# EAGLE schematic Arduino-M0-Pro-V4 (EAGLE 6.4)

## Sheet 1 of 3
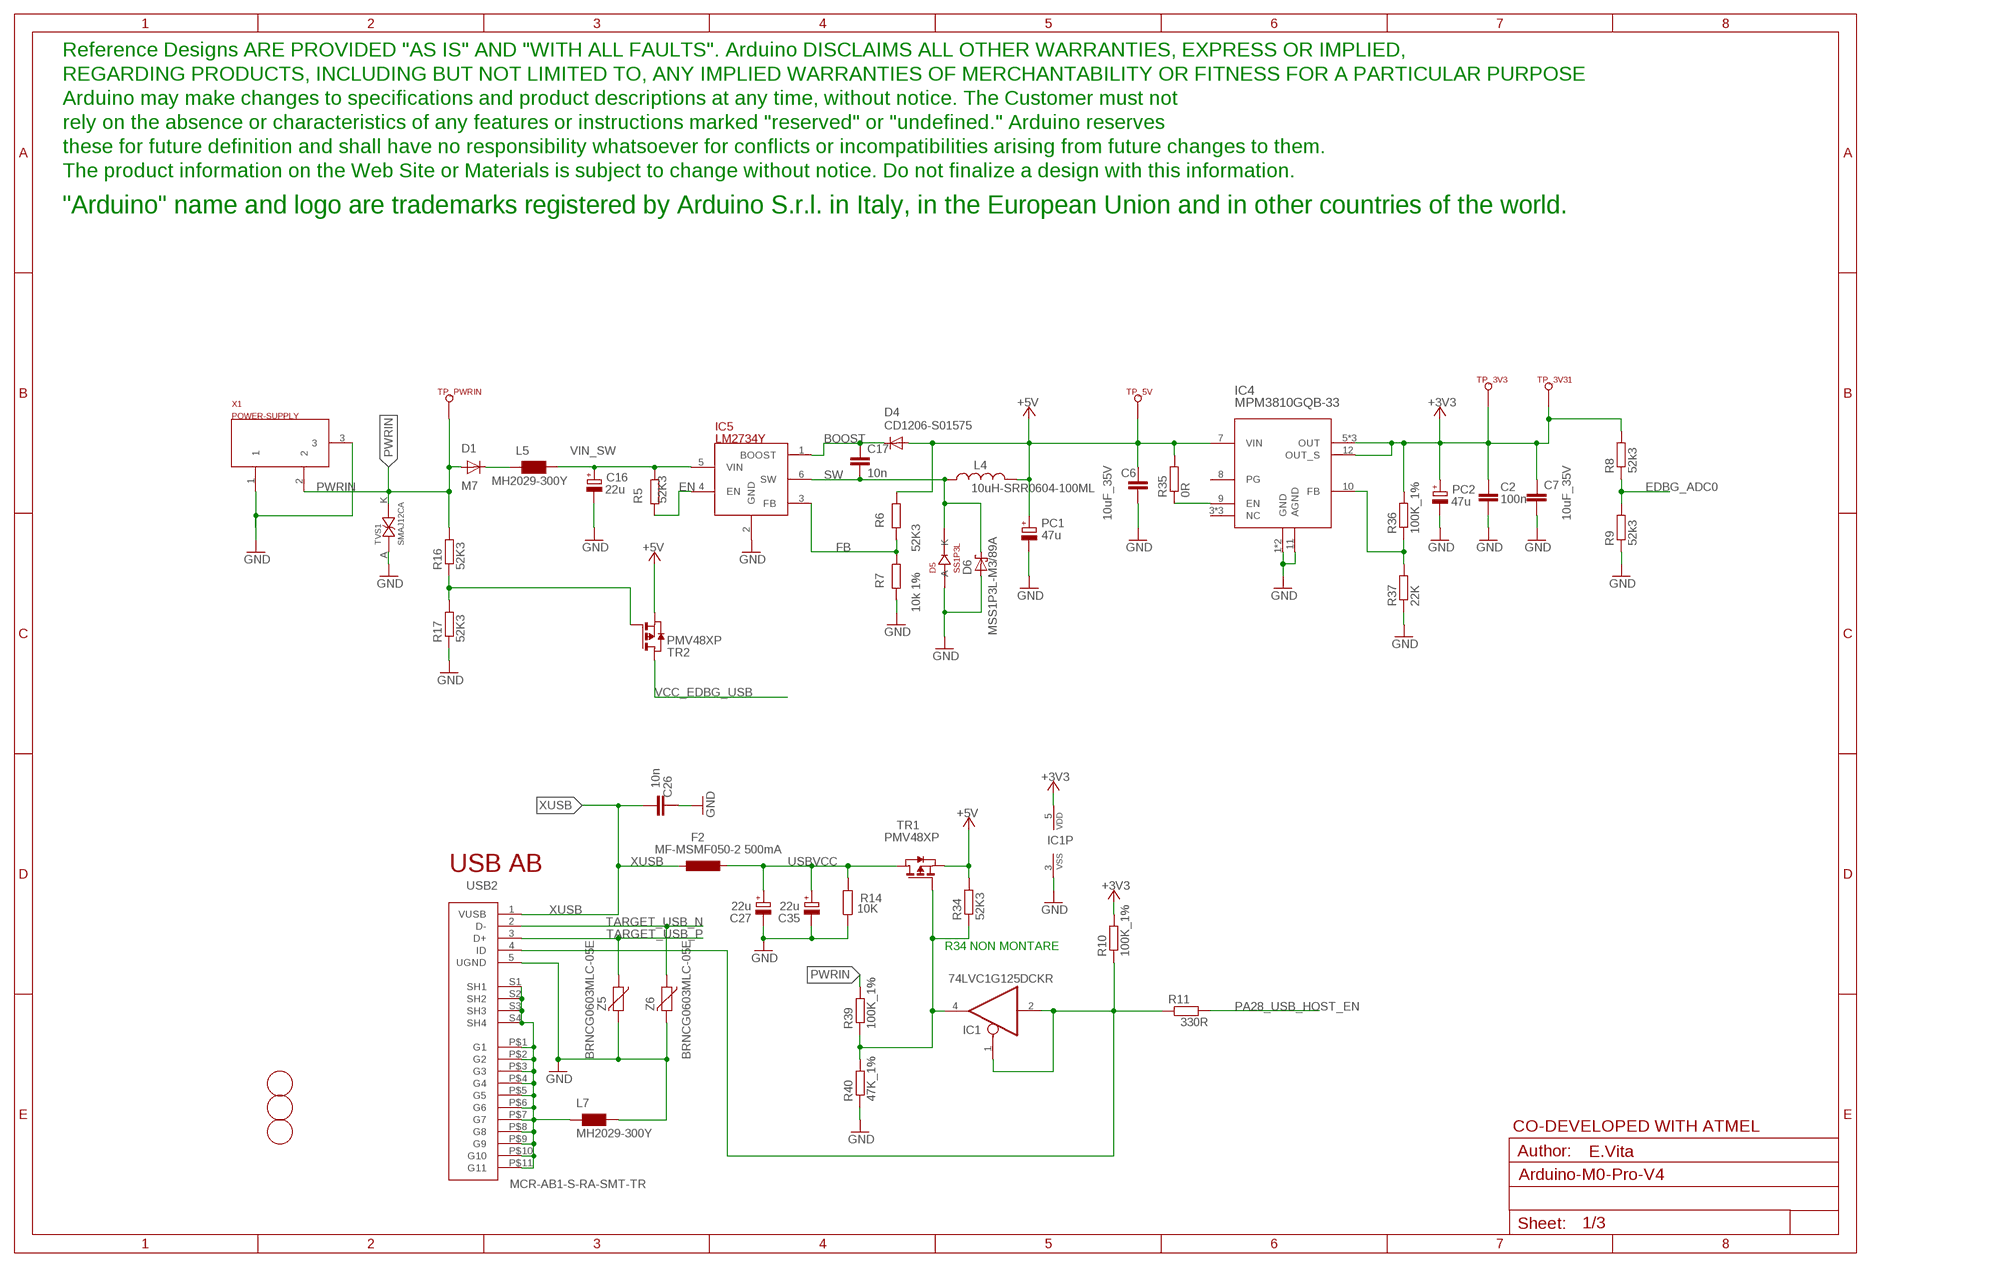
[diagram p0: schematic, sheet 1]

### Parts
C2  100n  0015_100NF_0603  [C0603-ROUND]
C6  10uF_35V  0674_GMK325BJ106KN-T  [C1210]
C7  10uF_35V  0674_GMK325BJ106KN-T  [C1210]
C16  22u  0167_  [SMC_B]
C17  10n  0142_10NF_0603  [C0603-ROUND]
C26  10n  0142_10NF_0603  [C0603-ROUND]
C27  22u  0167_  [SMC_B]
C35  22u  0167_  [SMC_B]
D1  M7  0020_M7  [SMB]
D4  CD1206-S01575  0012_CD1206-S01575  [MINIMELF]
D5  SS1P3L  0025_SS1P3L-M3/84A  [DO220AAL]
D6  MSS1P3L-M3/89A  1653_MSS1P3L-M3/89A  [MICROSMP]
F2  MF-MSMF050-2 500mA  0002_MF-MSMF050-2  [L1812]
FD1  FIDUCIALMOUNT  [FIDUCIA-MOUNT]
FD2  FIDUCIALMOUNT  [FIDUCIA-MOUNT]
FD3  FIDUCIALMOUNT  [FIDUCIA-MOUNT]
IC1  74LVC1G125DCKR  0040_SN74LVC1G125DCKR  [SC70-5]
IC4  MPM3810GQB-33  2068_MPM3810GQB-33  [QFN-12]
IC5  LM2734Y  0179_LM2734YMK  [SOT23-6]
L4  10uH-SRR0604-100ML  0031_SRR0604-100ML  [SRR0604]
L5  MH2029-300Y  0001_BLM21PG300SN1D_/_MH2029-300Y  [0805]
L7  MH2029-300Y  0001_BLM21PG300SN1D_/_MH2029-300Y  [0805]
PC1  47u  0113_47UF  [PANASONIC_D]
PC2  47u  0113_47UF  [PANASONIC_D]
R5  52K3  0180_52K3_0603  [R0603-ROUND]
R6  52K3  0180_52K3_0603  [R0603-ROUND]
R7  10k 1%  0899_CR0603FX1002ELF  [R0603-ROUND]
R8  52k3  0180_52K3_0603  [R0603-ROUND]
R9  52k3  0180_52K3_0603  [R0603-ROUND]
R10  100K_1%  2022_CR0603FW104L  [R0603-ROUND]
R11  330R  0049_330R_0603  [R0603-ROUND]
R14  10K  0028_CR0603JW103L  [R0603-ROUND]
R16  52K3  0180_52K3_0603  [R0603-ROUND]
R17  52K3  0180_52K3_0603  [R0603-ROUND]
R34  52K3  0180_52K3_0603  [R0603-ROUND]
R35  0R  0233_0R_0603  [R0603-ROUND]
R36  100K_1%  2022_CR0603FW104L  [R0603-ROUND]
R37  22K  0194_  [R0603-ROUND]
R39  100K_1%  2022_CR0603FW104L  [R0603-ROUND]
R40  47K_1%  0410_47K_0603_1%  [R0603-ROUND]
TP_3V3  TP_SP  [TP-SP]
TP_3V31  TP_SP  [TP-SP]
TP_5V  TP_SP  [TP-SP]
TP_PWRIN  TP_SP  [TP-SP]
TR1  PMV48XP  0297_PMV48XP  [SOT-23]
TR2  PMV48XP  0297_PMV48XP  [SOT-23]
TVS1  SMAJ12CA  XXXX_SMAJ12CA  [SMA-TVS]
U$1  DISCLAIMER  [DISCLAIMER]
USB2  MCR-AB1-S-RA-SMT-TR  0631_MCR-AB1-S-RA-SMT-TR  [MCR-AB1-S-RA-SMT]
X1  POWER-SUPPLY  0018_19746-POWER-SUPPLY  [POWERSUPPLY_DC-21MM]
Z5  BRNCG0603MLC-05E  0010_BRNCG0603MLC-05E  [CT/CN0603]
Z6  BRNCG0603MLC-05E  0010_BRNCG0603MLC-05E  [CT/CN0603]

### Nets
+3V3: C2.2 C7.1 IC1.5(VDD) IC4.5(OUT) IC4.6(OUT) IC4.12(OUT_S) IC4.14(OUT) PC2.+ R8.2 R10.2 R36.2 TP_3V3.X(TESTP) TP_3V31.X(TESTP) ; also sheet 2,3
+5V [usbvcc]: C6.1 D4.A IC4.7(VIN) L4.P$2 PC1.+ R6.1 R34.2 R35.2 TP_5V.X(TESTP) TR1.2(S) TR2.2(S) ; also sheet 2
BOOST: C17.1 D4.C IC5.1(BOOST)
EDBG_ADC0: R8.1 R9.2 ; also sheet 3
EN: IC5.4(EN) R5.2
FB: IC5.3(FB) R6.2 R7.1
GND [gnd]: C2.1 C6.2 C7.2 C16.- C26.2 C27.- C35.- D5.P$2(A) D6.A IC1.3(VSS) IC4.1(GND) IC4.2(GND) IC4.11(AGND) IC5.2(GND) L7.2 PC1.- PC2.- R7.2 R9.1 R14.1 R17.1 R37.1 R40.1 TVS1.A(AK) USB2.5(UGND) X1.1 X1.3 Z5.2 Z6.2 ; also sheet 2,3
N$4: IC1.4(O) R34.1 R39.1 R40.2 TR1.3(G)
N$7: IC1.1(OE) IC1.2(I) R10.1 R11.1 USB2.4(ID)
N$8: D1.C L5.1
N$9: IC4.9(EN) R35.1
N$11: IC4.10(FB) R36.1 R37.2
N$15 [gnd]: L7.1 USB2.P$1(G1) USB2.P$2(G2) USB2.P$3(G3) USB2.P$4(G4) USB2.P$5(G5) USB2.P$6(G6) USB2.P$7(G7) USB2.P$8(G8) USB2.P$9(G9) USB2.P$10(G10) USB2.P$11(G11) USB2.S1(SH1) USB2.S2(SH2) USB2.S3(SH3) USB2.S4(SH4)
N$16: R16.1 R17.2 TR2.3(G)
PA28_USB_HOST_EN: R11.2 ; also sheet 2
PWRIN [USB]: D1.A R16.2 R39.2 TP_PWRIN.X(TESTP) TVS1.K(KA) X1.2 ; also sheet 2
SW [USB]: C17.2 D5.P$1(K) D6.K(C) IC5.6(SW) L4.P$1
TARGET_USB_N [USBpair]: USB2.2(D-) Z6.1 ; also sheet 2
TARGET_USB_P [USBpair]: USB2.3(D+) Z5.1 ; also sheet 2
USBVCC [usbvcc]: C27.+ C35.+ F2.1 R14.2 TR1.1(D)
VCC_EDBG_USB: TR2.1(D) ; also sheet 3
VIN_SW [USB]: C16.+ IC5.5(VIN) L5.2 R5.1
XUSB [usbvcc]: C26.1 F2.2 USB2.1(VUSB)
Unconnected: IC4.3(NC) IC4.4(NC) IC4.8(PG) IC4.13(NC)

### Notes on the sheet
- USB AB
- R34 NON MONTARE
- CO-DEVELOPED WITH ATMEL
- E.Vita

## Sheet 2 of 3
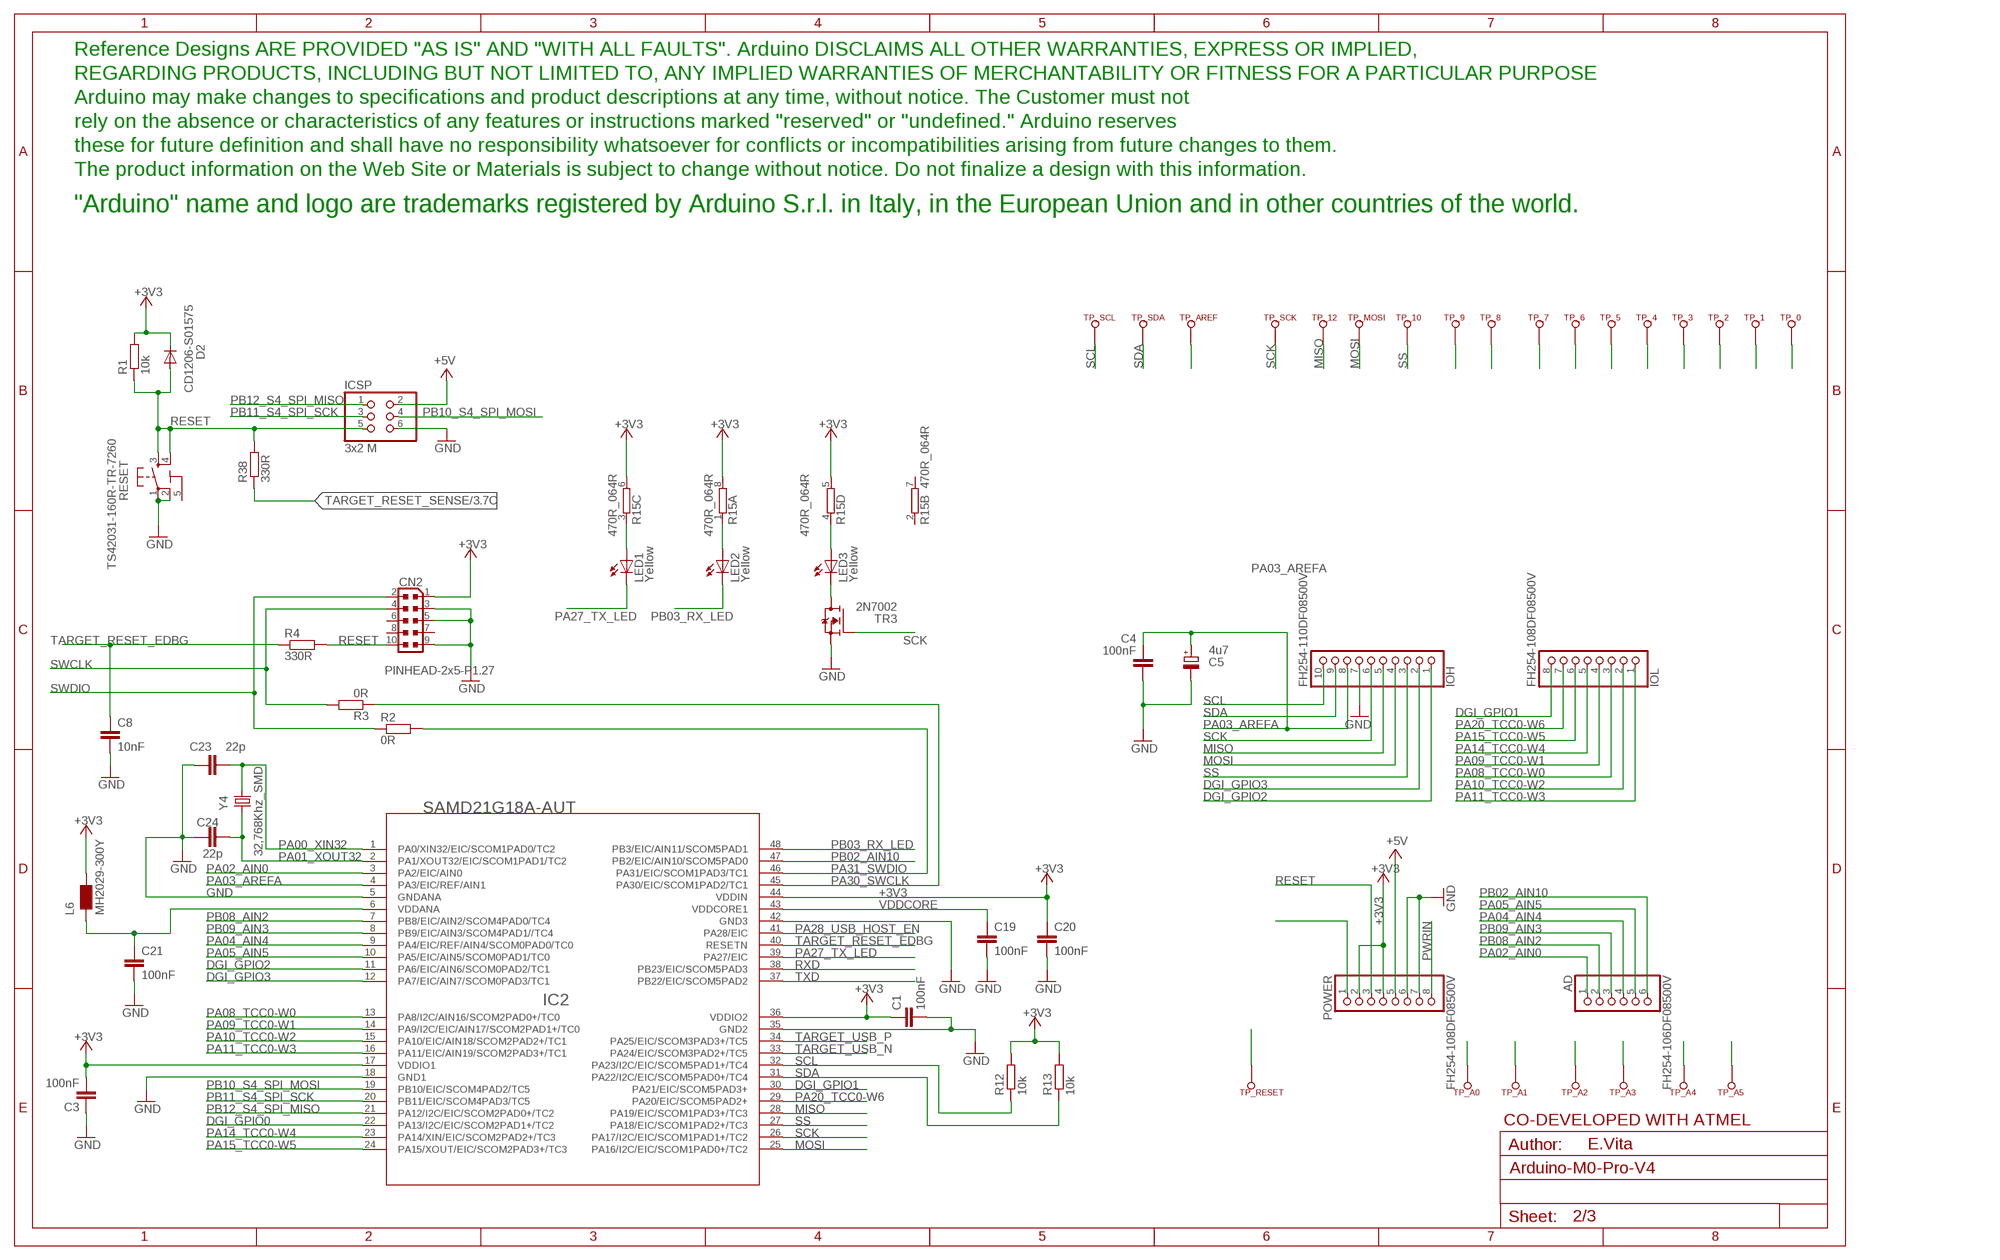
[diagram p1: schematic, sheet 2]

### Parts
AD  FH254-106DF08500V  1682_20TW-535_STD  [1X06]
C1  100nF  0015_100NF_0603  [C0603-ROUND]
C3  100nF  0015_100NF_0603  [C0603-ROUND]
C4  100nF  0015_100NF_0603  [C0603-ROUND]
C5  4u7  0474_TAJA475M016RNJ  [SMC_A]
C8  10nF  0142_10NF_0603  [C0603-ROUND]
C19  100nF  0015_100NF_0603  [C0603-ROUND]
C20  100nF  0015_100NF_0603  [C0603-ROUND]
C21  100nF  0015_100NF_0603  [C0603-ROUND]
C23  22p  0014_22PF_0603  [C0603-ROUND]
C24  22p  0014_22PF_0603  [C0603-ROUND]
CN2  PINHEAD-2x5-P1.27  0171_PH127-205DF055G00AROUND-PADS  [PINHEAD_2X05_127]
D2  CD1206-S01575  0012_CD1206-S01575  [MINIMELF]
IC2  SAMD21G18A-AUT  1792_SAMD21G18A-AUT  [TQFP48-7X7]
ICSP  3x2 M  0114_PH254-203DF118A00V  [2X03]
IOH  FH254-110DF08500V  1684_20TW-537  [1X10]
IOL  FH254-108DF08500V  1683_20TW-536  [1X08]
L6  MH2029-300Y  0001_BLM21PG300SN1D_/_MH2029-300Y  [0805]
LED1  Yellow  0044_KPT-2012YC  [CHIPLED_0805]
LED2  Yellow  0044_KPT-2012YC  [CHIPLED_0805]
LED3  Yellow  0044_KPT-2012YC  [CHIPLED_0805]
POWER  FH254-108DF08500V  1683_20TW-536  [1X08]
R1  10k  0028_CR0603JW103L  [R0603-ROUND]
R2  0R  0233_0R_0603  [R0603-ROUND]
R3  0R  0233_0R_0603  [R0603-ROUND]
R4  330R  0049_330R_0603  [R0603-ROUND]
R12  10k  0028_CR0603JW103L  [R0603-ROUND]
R13  10k  0028_CR0603JW103L  [R0603-ROUND]
R15  470R_064R  0540_CAY16-471J4LF  [CAY16]
R38  330R  0049_330R_0603  [R0603-ROUND]
RESET  TS42031-160R-TR-7260  0946_TS42031-160W-TR-7260  [TS42]
TP_0  TP_SP  [TP-SP]
TP_1  TP_SP  [TP-SP]
TP_2  TP_SP  [TP-SP]
TP_3  TP_SP  [TP-SP]
TP_4  TP_SP  [TP-SP]
TP_5  TP_SP  [TP-SP]
TP_6  TP_SP  [TP-SP]
TP_7  TP_SP  [TP-SP]
TP_8  TP_SP  [TP-SP]
TP_9  TP_SP  [TP-SP]
TP_10  TP_SP  [TP-SP]
TP_12  TP_SP  [TP-SP]
TP_A0  TP_SP  [TP-SP]
TP_A1  TP_SP  [TP-SP]
TP_A2  TP_SP  [TP-SP]
TP_A3  TP_SP  [TP-SP]
TP_A4  TP_SP  [TP-SP]
TP_A5  TP_SP  [TP-SP]
TP_AREF  TP_SP  [TP-SP]
TP_MOSI  TP_SP  [TP-SP]
TP_RESET  TP_SP  [TP-SP]
TP_SCK  TP_SP  [TP-SP]
TP_SCL  TP_SP  [TP-SP]
TP_SDA  TP_SP  [TP-SP]
TR3  2N7002  1612_2N7002LT1G  [SOT-23]
U$2  DISCLAIMER  [DISCLAIMER]
Y4  32,768Khz_SMD  0213_ABS07-32.768KHZ-T  [RESONATOR_EPSON_FC_145]

### Nets
+3V3: C1.1 C3.2 C20.1 CN2.1 D2.C IC2.17(VDDIO1) IC2.36(VDDIO2) IC2.44(VDDIN) L6.2 POWER.2 POWER.4 R1.2 R12.2 R13.2 R15.5 R15.6 R15.8 ; also sheet 1,3
+5V [usbvcc]: ICSP.2 POWER.5 ; also sheet 1
DGI_GPIO0: IC2.22(PA13/I2C/EIC/SCOM2PAD1+/TC2) ; also sheet 3
DGI_GPIO1: IC2.30(PA21/EIC/SCOM5PAD3+) IOL.8 TP_7.X(TESTP) ; also sheet 3
DGI_GPIO2: IC2.11(PA6/EIC/AIN6/SCOM0PAD2/TC1) IOH.1 TP_8.X(TESTP) ; also sheet 3
DGI_GPIO3: IC2.12(PA7/EIC/AIN7/SCOM0PAD3/TC1) IOH.2 TP_9.X(TESTP) ; also sheet 3
GND [gnd]: C1.2 C3.1 C4.2 C5.- C8.2 C19.2 C20.2 C21.2 C23.1 C24.1 CN2.3 CN2.5 CN2.9 IC2.5(GNDANA) IC2.18(GND1) IC2.35(GND2) IC2.42(GND3) ICSP.6 IOH.7 POWER.6 POWER.7 RESET.1 RESET.2 TR3.2(S) ; also sheet 1,3
MISO: IC2.28(PA19/EIC/SCOM1PAD3+/TC3) IOH.5 TP_12.X(TESTP) ; also sheet 3
MOSI: IC2.25(PA16/I2C/EIC/SCOM1PAD0+/TC2) IOH.4 TP_MOSI.X(TESTP) ; also sheet 3
N$3: LED3.C TR3.1(D)
N$10: C21.1 IC2.6(VDDANA) L6.1
N$20: LED1.A R15.3
N$21: LED2.A R15.1
N$22: LED3.A R15.4
N$56: POWER.1
PA00_XIN32: C23.2 IC2.1(PA0/XIN32/EIC/SCOM1PAD0/TC2) Y4.P$2
PA01_XOUT32: C24.2 IC2.2(PA1/XOUT32/EIC/SCOM1PAD1/TC2) Y4.P$1
PA02_AIN0: AD.1 IC2.3(PA2/EIC/AIN0) TP_A0.X(TESTP)
PA03_AREFA: C4.1 C5.+ IC2.4(PA3/EIC/REF/AIN1) IOH.8 TP_AREF.X(TESTP)
PA04_AIN4: AD.4 IC2.9(PA4/EIC/REF/AIN4/SCOM0PAD0/TC0) TP_A3.X(TESTP)
PA05_AIN5: AD.5 IC2.10(PA5/EIC/AIN5/SCOM0PAD1/TC0) TP_A4.X(TESTP)
PA08_TCC0-W0: IC2.13(PA8/I2C/AIN16/SCOM2PAD0+/TC0) IOL.3 TP_2.X(TESTP)
PA09_TCC0-W1: IC2.14(PA9/I2C/EIC/AIN17/SCOM2PAD1+/TC0) IOL.4 TP_3.X(TESTP)
PA10_TCC0-W2: IC2.15(PA10/EIC/AIN18/SCOM2PAD2+/TC1) IOL.2 TP_1.X(TESTP)
PA11_TCC0-W3: IC2.16(PA11/EIC/AIN19/SCOM2PAD3+/TC1) IOL.1 TP_0.X(TESTP)
PA14_TCC0-W4: IC2.23(PA14/XIN/EIC/SCOM2PAD2+/TC3) IOL.5 TP_4.X(TESTP)
PA15_TCC0-W5: IC2.24(PA15/XOUT/EIC/SCOM2PAD3+/TC3) IOL.6 TP_5.X(TESTP)
PA20_TCC0-W6: IC2.29(PA20/EIC/SCOM5PAD2+) IOL.7 TP_6.X(TESTP)
PA27_TX_LED: IC2.39(PA27/EIC) LED1.C
PA28_USB_HOST_EN: IC2.41(PA28/EIC) ; also sheet 1
PA30_SWCLK: IC2.45(PA30/EIC/SCOM1PAD2/TC1) R3.1
PA31_SWDIO: IC2.46(PA31/EIC/SCOM1PAD3/TC1) R2.2
PB02_AIN10: AD.6 IC2.47(PB2/EIC/AIN10/SCOM5PAD0) TP_A5.X(TESTP)
PB03_RX_LED: IC2.48(PB3/EIC/AIN11/SCOM5PAD1) LED2.C
PB08_AIN2: AD.2 IC2.7(PB8/EIC/AIN2/SCOM4PAD0/TC4) TP_A1.X(TESTP)
PB09_AIN3: AD.3 IC2.8(PB9/EIC/AIN3/SCOM4PAD1//TC4) TP_A2.X(TESTP)
PB10_S4_SPI_MOSI: IC2.19(PB10/EIC/SCOM4PAD2/TC5) ICSP.4
PB11_S4_SPI_SCK: IC2.20(PB11/EIC/SCOM4PAD3/TC5) ICSP.3
PB12_S4_SPI_MISO: IC2.21(PA12/I2C/EIC/SCOM2PAD0+/TC2) ICSP.1
PWRIN [USB]: POWER.8 ; also sheet 1
RESET: CN2.10 D2.A ICSP.5 POWER.3 R1.1 R4.2 R38.2 RESET.3 RESET.4 TP_RESET.X(TESTP)
RXD: IC2.38(PB23/EIC/SCOM5PAD3) ; also sheet 3
SCK: IC2.26(PA17/I2C/EIC/SCOM1PAD1+/TC2) IOH.6 TP_SCK.X(TESTP) TR3.3(G) ; also sheet 3
SCL: IC2.32(PA23/I2C/EIC/SCOM5PAD1+/TC4) IOH.10 R12.1 TP_SCL.X(TESTP) ; also sheet 3
SDA: IC2.31(PA22/I2C/EIC/SCOM5PAD0+/TC4) IOH.9 R13.1 TP_SDA.X(TESTP) ; also sheet 3
SS: IC2.27(PA18/EIC/SCOM1PAD2+/TC3) IOH.3 TP_10.X(TESTP) ; also sheet 3
SWCLK: CN2.4 R3.2 ; also sheet 3
SWDIO: CN2.2 R2.1 ; also sheet 3
TARGET_RESET_EDBG: C8.1 IC2.40(RESETN) R4.1 ; also sheet 3
TARGET_RESET_SENSE: R38.1 ; also sheet 3
TARGET_USB_N [USBpair]: IC2.33(PA24/EIC/SCOM3PAD2+/TC5) ; also sheet 1
TARGET_USB_P [USBpair]: IC2.34(PA25/EIC/SCOM3PAD3+/TC5) ; also sheet 1
TXD: IC2.37(PB22/EIC/SCOM5PAD2) ; also sheet 3
VDDCORE: C19.1 IC2.43(VDDCORE1)
Unconnected: CN2.6 CN2.7 CN2.8 R15.2 R15.7

### Notes on the sheet
- CO-DEVELOPED WITH ATMEL
- E.Vita

## Sheet 3 of 3
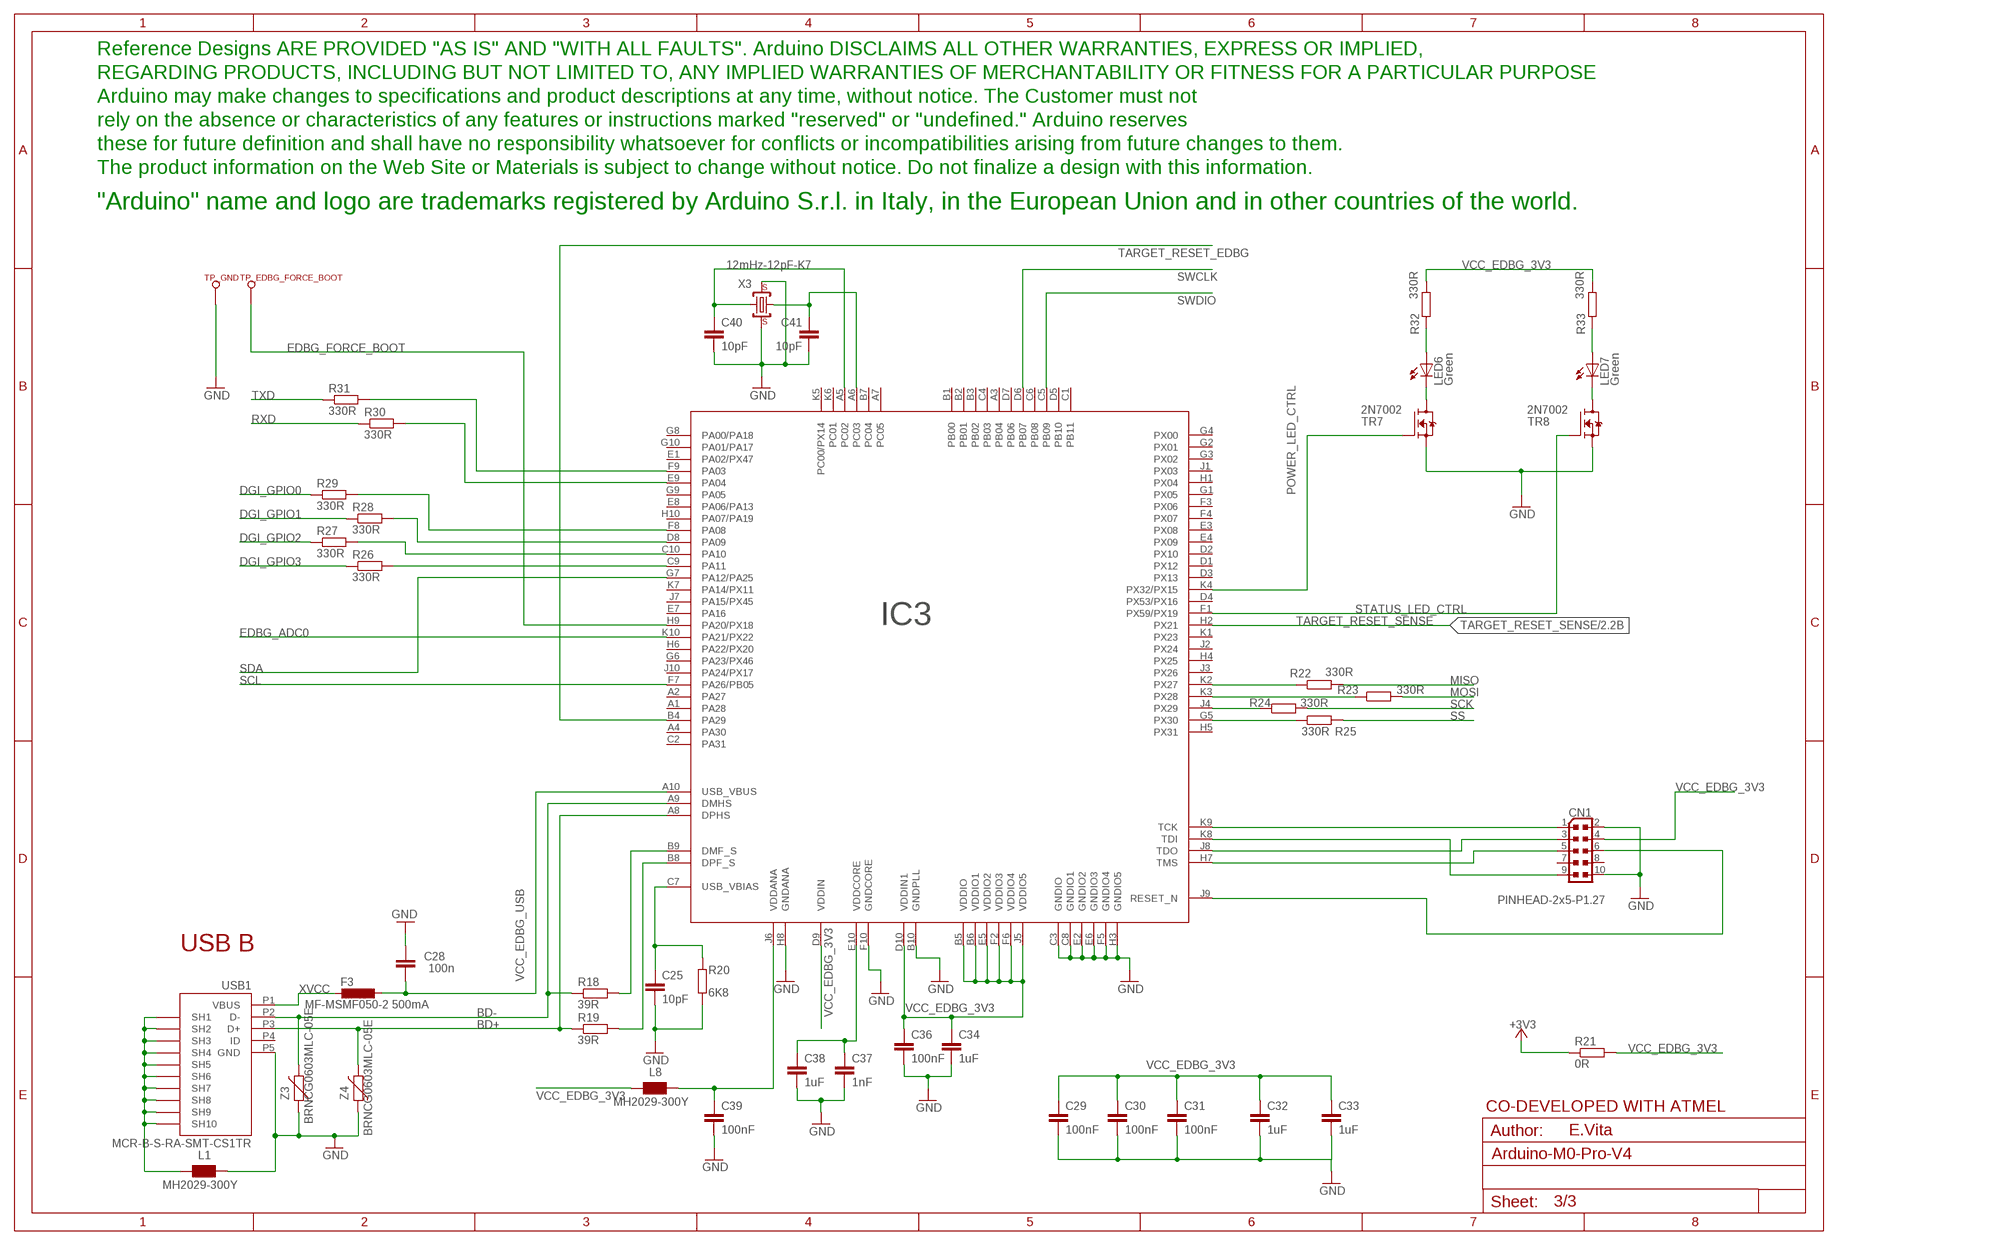
[diagram p2: schematic, sheet 3]

### Parts
C25  10pF  0245_0603C0G10PF50V  [C0603-ROUND]
C28  100n  0015_100NF_0603  [C0603-ROUND]
C29  100nF  0015_100NF_0603  [C0603-ROUND]
C30  100nF  0015_100NF_0603  [C0603-ROUND]
C31  100nF  0015_100NF_0603  [C0603-ROUND]
C32  1uF  0006_1UF_0603/GRM188R61E105KA12D  [C0603-ROUND]
C33  1uF  0006_1UF_0603/GRM188R61E105KA12D  [C0603-ROUND]
C34  1uF  0006_1UF_0603/GRM188R61E105KA12D  [C0603-ROUND]
C36  100nF  0015_100NF_0603  [C0603-ROUND]
C37  1nF  0408_1NF_0603  [C0603-ROUND]
C38  1uF  0006_1UF_0603/GRM188R61E105KA12D  [C0603-ROUND]
C39  100nF  0015_100NF_0603  [C0603-ROUND]
C40  10pF  0245_0603C0G10PF50V  [C0603-ROUND]
C41  10pF  0245_0603C0G10PF50V  [C0603-ROUND]
CN1  PINHEAD-2x5-P1.27  0171_PH127-205DF055G00AROUND-PADS  [PINHEAD_2X05_127]
F3  MF-MSMF050-2 500mA  0002_MF-MSMF050-2  [L1812]
IC3  1791_AT32UC3A4256HHB-C1UR  [VFBGA100]
L1  MH2029-300Y  0001_BLM21PG300SN1D_/_MH2029-300Y  [0805]
L8  MH2029-300Y  0001_BLM21PG300SN1D_/_MH2029-300Y  [0805]
LED6  Green  0043_KPT-2012SGC  [CHIPLED_0805]
LED7  Green  0043_KPT-2012SGC  [CHIPLED_0805]
R18  39R  0176_39_R_0603  [R0603-ROUND]
R19  39R  0176_39_R_0603  [R0603-ROUND]
R20  6K8  0164_6K8_0603  [R0603-ROUND]
R21  0R  0233_0R_0603  [R0603-ROUND]
R22  330R  0049_330R_0603  [R0603-ROUND]
R23  330R  0049_330R_0603  [R0603-ROUND]
R24  330R  0049_330R_0603  [R0603-ROUND]
R25  330R  0049_330R_0603  [R0603-ROUND]
R26  330R  0049_330R_0603  [R0603-ROUND]
R27  330R  0049_330R_0603  [R0603-ROUND]
R28  330R  0049_330R_0603  [R0603-ROUND]
R29  330R  0049_330R_0603  [R0603-ROUND]
R30  330R  0049_330R_0603  [R0603-ROUND]
R31  330R  0049_330R_0603  [R0603-ROUND]
R32  330R  0049_330R_0603  [R0603-ROUND]
R33  330R  0049_330R_0603  [R0603-ROUND]
TP_EDBG_FORCE_BOOT  TP_SP  [TP-SP]
TP_GND  TP_SP  [TP-SP]
TR7  2N7002  1612_2N7002LT1G  [SOT-23]
TR8  2N7002  1612_2N7002LT1G  [SOT-23]
U$3  DISCLAIMER  [DISCLAIMER]
USB1  MCR-B-S-RA-SMT-CS1TR  0158_MCR-B-S-RA-SMT-CS1TR  [CON2_USB_MICRO_B_AT]
X3  12mHz-12pF-K7  0396_12MHZ-12PF-K7  [CRYSTAL-3.2-2.5]
Z3  BRNCG0603MLC-05E  0010_BRNCG0603MLC-05E  [CT/CN0603]
Z4  BRNCG0603MLC-05E  0010_BRNCG0603MLC-05E  [CT/CN0603]

### Nets
+3V3: R21.1 ; also sheet 1,2
BD+ [USBpair]: IC3.A8(DPHS) R19.1 USB1.P3(D+) Z4.2
BD- [USBpair]: IC3.A9(DMHS) R18.1 USB1.P2(D-) Z3.2
DGI_GPIO0: R29.1 ; also sheet 2
DGI_GPIO1: R28.1 ; also sheet 2
DGI_GPIO2: R27.1 ; also sheet 2
DGI_GPIO3: R26.1 ; also sheet 2
EDBG_ADC0: IC3.K10(PA21/PX22) ; also sheet 1
EDBG_FORCE_BOOT: IC3.H9(PA20/PX18) TP_EDBG_FORCE_BOOT.X(TESTP)
GND [gnd]: C25.2 C28.2 C29.2 C30.2 C31.2 C32.2 C33.2 C34.2 C36.2 C37.2 C38.2 C39.2 C40.2 C41.2 CN1.2 CN1.10 IC3.B10(GNDPLL) IC3.C3(GNDIO) IC3.C8(GNDIO1) IC3.E2(GNDIO2) IC3.E6(GNDIO3) IC3.F5(GNDIO4) IC3.F10(GNDCORE) IC3.H3(GNDIO5) IC3.H8(GNDANA) L1.2 R20.1 TP_GND.X(TESTP) TR7.2(S) TR8.2(S) USB1.P5(GND) X3.2(GND) X3.4(GND) Z3.1 Z4.1 ; also sheet 1,2
MISO: R22.2 ; also sheet 2
MOSI: R23.2 ; also sheet 2
N$1: LED6.C TR7.1(D)
N$2: LED7.C TR8.1(D)
N$5 [gnd]: L1.1 USB1.P$1(SH7) USB1.P$2(SH8) USB1.P$3(SH9) USB1.P$4(SH10) USB1.P$5(SH7) USB1.P$6(SH8) USB1.P$7(SH9) USB1.P$8(SH10) USB1.S1(SH1) USB1.S2(SH2) USB1.S3(SH3) USB1.S4(SH4) USB1.S5(SH5) USB1.S6(SH6)
N$18: IC3.B9(DMF_S) R18.2
N$19: IC3.B8(DPF_S) R19.2
N$23: C25.1 IC3.C7(USB_VBIAS) R20.2
N$24: C41.1 IC3.A6(PC03) X3.1(C1)
N$25: C40.1 IC3.A5(PC02) X3.3(C2)
N$26: C37.1 C38.1 IC3.E10(VDDCORE)
N$27: C39.1 IC3.J6(VDDANA) L8.2
N$34: IC3.K2(PX27) R22.1
N$37: IC3.K3(PX28) R23.1
N$38: IC3.J4(PX29) R24.1
N$39: IC3.G5(PX30) R25.1
N$40: IC3.C9(PA11) R26.2
N$41: IC3.C10(PA10) R27.2
N$42: IC3.D8(PA09) R28.2
N$43: IC3.F8(PA08) R29.2
N$44: IC3.E9(PA04) R30.2
N$45: IC3.F9(PA03) R31.2
N$57: CN1.1 IC3.K9(TCK)
N$58: CN1.9 IC3.K8(TDI)
N$59: CN1.3 IC3.J8(TDO)
N$60: CN1.5 IC3.H7(TMS)
N$61: CN1.6 IC3.J9(RESET_N)
N$67: LED6.A R32.1
N$68: LED7.A R33.1
POWER_LED_CTRL: IC3.K4(PX32/PX15) TR7.3(G)
RXD: R30.1 ; also sheet 2
SCK: R24.2 ; also sheet 2
SCL: IC3.F7(PA26/PB05) ; also sheet 2
SDA: IC3.G7(PA12/PA25) ; also sheet 2
SS: R25.2 ; also sheet 2
STATUS_LED_CTRL: IC3.F1(PX59/PX19) TR8.3(G)
SWCLK: IC3.D6(PB07) ; also sheet 2
SWDIO: IC3.C5(PB09) ; also sheet 2
TARGET_RESET_EDBG: IC3.B4(PA29) ; also sheet 2
TARGET_RESET_SENSE: IC3.H2(PX21) ; also sheet 2
TXD: R31.1 ; also sheet 2
VCC_EDBG_3V3: C29.1 C30.1 C31.1 C32.1 C33.1 C34.1 C36.1 CN1.4 IC3.B5(VDDIO) IC3.B6(VDDIO1) IC3.D9(VDDIN) IC3.D10(VDDIN1) IC3.E5(VDDIO2) IC3.F2(VDDIO3) IC3.F6(VDDIO4) IC3.J5(VDDIO5) L8.1 R21.2 R32.2 R33.2
VCC_EDBG_USB: C28.1 F3.1 IC3.A10(USB_VBUS) ; also sheet 1
XVCC [usbvcc]: F3.2 USB1.P1(VBUS)
Unconnected: CN1.7 CN1.8 IC3.A1(PA28) IC3.A2(PA27) IC3.A3(PB04) IC3.A4(PA30) IC3.A7(PC05) IC3.B1(PB00) IC3.B2(PB01) IC3.B3(PB02) IC3.B7(PC04) IC3.C1(PB11) IC3.C2(PA31) IC3.C4(PB03) IC3.C6(PB08) IC3.D1(PX12) IC3.D2(PX10) IC3.D3(PX13) IC3.D4(PX53/PX16) IC3.D5(PB10) IC3.D7(PB06) IC3.E1(PA02/PX47) IC3.E3(PX08) IC3.E4(PX09) IC3.E7(PA16) IC3.E8(PA06/PA13) IC3.F3(PX06) IC3.F4(PX07) IC3.G1(PX05) IC3.G2(PX01) IC3.G3(PX02) IC3.G4(PX00) IC3.G6(PA23/PX46) IC3.G8(PA00/PA18) IC3.G9(PA05) IC3.G10(PA01/PA17) IC3.H1(PX04) IC3.H4(PX25) IC3.H5(PX31) IC3.H6(PA22/PX20) IC3.H10(PA07/PA19) IC3.J1(PX03) IC3.J2(PX24) IC3.J3(PX26) IC3.J7(PA15/PX45) IC3.J10(PA24/PX17) IC3.K1(PX23) IC3.K5(PC00/PX14) IC3.K6(PC01) IC3.K7(PA14/PX11) USB1.P4(ID)

### Notes on the sheet
- USB B
- CO-DEVELOPED WITH ATMEL
- E.Vita

## Power pins joined to a net without a drawn wire
5-GND: RESET.5(5-GND)

## Library data of the parts
AD = Connettori:1682_20TW-535: Female Gray Connector strip for Arduino 3V3 bases - 6x1 F V h 8,5 p2,54; MONTHLY_USAGE: 86722.85; PART_NUMBER: 20TW-535; PRICE: _0.03; SUPPLIER: CBC_elettronica__s.r.l.; TYPE: Connettori
C1 C3 C4 C19-C21 C29-C31 C36 C39 = Condensatori:0015_100NF_0603: 100nF 0603 50V; CASE: 0603; MONTHLY_USAGE: _____; PART_NUMBER: cl10b104kbnc; PRICE: _____; SUPPLIER: _____; TYPE: Condensatori
C2 C28 = Condensatori:0015_100NF_0603: 100nF 0603 50V; CASE: 0603; MONTHLY_USAGE: _____; PART_NUMBER: cl10b104kbnc; PRICE: _____; SUPPLIER: _____; TYPE: Condensatori; VALUE: 100nF
C5 = Condensatori:0474_TAJA475M016RNJ: 4u7 tantalio Case A - testa gialla -Tantalio; CASE: CaseA_(1206); MONTHLY_USAGE: _____; PART_NUMBER: TAJA475M016RNJ; PRICE: _____; SUPPLIER: _____; TYPE: Condensatori
C6 C7 = Condensatori:0674_GMK325BJ106KN-T: 10uF 35V caseB tantalio; CASE: Case_B_(1210); MONTHLY_USAGE: _____; PART_NUMBER: GMK325BJ106KN-T; PRICE: _____; SUPPLIER: _____; TYPE: Condensatori
C8 = Condensatori:0142_10NF_0603: 10nF 0603; CASE: 0603; MONTHLY_USAGE: _____; PART_NUMBER: 10nF_0603; PRICE: _____; SUPPLIER: _____; TYPE: Condensatori
C16 C27 C35 = Condensatori:0167_: 22uF 25V; MONTHLY_USAGE: _____; PRICE: _____; SUPPLIER: _____; TYPE: Condensatori; VALUE: 22uF
C17 C26 = Condensatori:0142_10NF_0603: 10nF 0603; CASE: 0603; MONTHLY_USAGE: _____; PART_NUMBER: 10nF_0603; PRICE: _____; SUPPLIER: _____; TYPE: Condensatori; VALUE: 10nF
C23 C24 = Condensatori:0014_22PF_0603: 22pF 0603; CASE: 0603; MONTHLY_USAGE: _____; PART_NUMBER: 22pF_0603; PRICE: _____; SUPPLIER: _____; TYPE: Condensatori
C25 C40 C41 = Condensatori:0245_0603C0G10PF50V: 10pF 0603; CASE: 0603; MONTHLY_USAGE: _____; PART_NUMBER: 0603C0G10PF50V; PRICE: _____; SUPPLIER: _____; TYPE: Condensatori
C32-C34 C38 = Condensatori:0006_1UF_0603/GRM188R61E105KA12D: 1uF 0603; CASE: 0603; MONTHLY_USAGE: _____; PART_NUMBER: 1uF_0603/GRM188R61E105KA12D; PRICE: _____; SUPPLIER: _____; TYPE: Condensatori
C37 = Condensatori:0408_1NF_0603: 1nF 0603; CASE: 0603; MONTHLY_USAGE: _____; PART_NUMBER: 1nF_0603; PRICE: _____; SUPPLIER: _____; TYPE: Condensatori
CN1 CN2 = Connettori:0171_PH127-205DF055G00A: 2x5 PASSO 1,27
D1 = Diodi:0020_M7: 1.0A 40V SURFACE MOUNT GLASS PASSIVATED RECTIFIER M7; CASE: SMA; MONTHLY_USAGE: _____; PART_NUMBER: M7; PRICE: _____; SUPPLIER: _____; TYPE: Diodi
D2 D4 = Diodi:0012_CD1206-S01575: small-signal high-speed Switching Diodes CD1206; CASE: 1206; MONTHLY_USAGE: _____; PART_NUMBER: CD1206-S01575; PRICE: _____; SUPPLIER: _____; TYPE: Diodi
D5 = Diodi:0025_SS1P3L-M3/84A: 1A 30V Schottky Barrier Rectifiers -SS1P3L-M3/84A; CASE: SMP; MONTHLY_USAGE: _____; PART_NUMBER: SS1P3L-M3/84A; PRICE: _____; SUPPLIER: _____; TYPE: Diodi
D6 = Diodi:1653_MSS1P3L-M3/89A: Surface Mount Schottky Barrier Rectifiers - Case microSMP
F2 F3 = Protezione:0002_MF-MSMF050-2: 500 mA Multifuse � Polyfuse; MONTHLY_USAGE: _____; PART_NUMBER: MF-MSMF050-2; PRICE: _____; SUPPLIER: _____; TYPE: Protezione
FD1-FD3 = SmartPrj:FIDUCIALMOUNT
IC1 = IntegratedCircuits:0040_SN74LVC1G125DCKR: Single bus buffer with 3-state output; CASE: SC70; MONTHLY_USAGE: _____; PART_NUMBER: SN74LVC1G125DCKR; PRICE: _____; SUPPLIER: _____; TYPE: Circuito_Integrato
IC2 = IntegratedCircuits:1792_SAMD21G18A-AUT: Atmel D21 32bit ARM Cortex-M0 microcontroller - 48 PIN TQFP 256KB flash memory + 32KB SRAM
IC3 = IntegratedCircuits:1791_AT32UC3A4256HHB-C1UR: ATMEL 32-bit AVR Microcontroller - VFBGA100
IC4 = IntegratedCircuits:2068_MPM3810GQB-33: MPM3810 6V Input, 1.2A Module Synchronous Step-Down Converter with Integrated Inductor; PART_NUMBER: MPM3810GQB-33
IC5 = Circuito Integrato:0179_LM2734YMK: 1A Load Step-Down DC-DC Regulator - LM2734Y Switching; CASE: SOT23-5; MONTHLY_USAGE: _____; PART_NUMBER: LM2734YMK; PRICE: _____; SUPPLIER: _____; TYPE: Circuito_Integrato; VALUE: LM2734YMK
ICSP = Connettori:0114_PH254-203DF118A00V: 3x2 M V h 8,5 mm p2,54; MONTHLY_USAGE: _____; PART_NUMBER: PH254-203DF118A00V; PRICE: _____; SUPPLIER: _____; TYPE: Connettori; VALUE: ICSP
IOH = Connettori:1684_20TW-537: Female Gray Connector strip for Arduino 3V3 bases - 10x1 F V h 8,5 p2,54mm; MONTHLY_USAGE: _____; PART_NUMBER: 20TW-537; PRICE: _____; SUPPLIER: _____; TYPE: Connettori
IOL POWER = Connettori:1683_20TW-536: Female Gray Connector strip for Arduino 3V3 bases - 8x1 F V h 8,5 p2,54mm; MONTHLY_USAGE: _____; PART_NUMBER: 20TW-536; PRICE: _____; SUPPLIER: _____; TYPE: Connettori
L1 L5-L8 = Protezione:0001_BLM21PG300SN1D_/_MH2029-300Y: BLM21; MONTHLY_USAGE: _____; PART_NUMBER: BLM21PG300SN1D_/_MH2029-300Y; PRICE: _____; SUPPLIER: _____; TYPE: Protezione
L4 = Induttanze:0031_SRR0604-100ML: SRR0604-100ML; CASE: SMD_6,5x6,5; MONTHLY_USAGE: _____; PART_NUMBER: SRR0604-100ML; PRICE: _____; SUPPLIER: _____; TYPE: Induttanze
LED1-LED3 = Opto:0044_KPT-2012YC: LED YELLOW - SMD - 0805; MONTHLY_USAGE: _____; PART_NUMBER: KPT-2012YC; PRICE: _____; SUPPLIER: _____; TYPE: Opto
LED6 LED7 = Opto:0043_KPT-2012SGC: LED GREEN - SMD-0805; MONTHLY_USAGE: _____; PART_NUMBER: KPT-2012SGC; PRICE: _____; SUPPLIER: _____; TYPE: Opto
PC1 PC2 = Condensatori:0113_47UF: 47uF; MONTHLY_USAGE: _____; PART_NUMBER: 47uF; PRICE: _____; SUPPLIER: _____; TYPE: Condensatori; VALUE: 47uF
R1 R12 R13 = Resistenze:0028_CR0603JW103L: 10K 0603; CASE: 0603; MONTHLY_USAGE: _____; PART_NUMBER: CR0603JW103L; PRICE: _____; SUPPLIER: _____; TYPE: Resistenze
R2 R3 R21 R35 = Resistenze:0233_0R_0603: 0R 0603; CASE: 0603; MONTHLY_USAGE: _____; PART_NUMBER: 0R_0603; PRICE: _____; SUPPLIER: _____; TYPE: Resistenze
R4 R11 R22-R33 R38 = Resistenze:0049_330R_0603: 330R 0603; CASE: 0603; MONTHLY_USAGE: _____; PART_NUMBER: 330R_0603; PRICE: _____; SUPPLIER: _____; TYPE: Resistenze
R5 R6 R16 R17 R34 = Resistenze:0180_52K3_0603: 52k3 0603; CASE: 0603; MONTHLY_USAGE: _____; PART_NUMBER: 52k3_0603; PRICE: _____; SUPPLIER: _____; TYPE: Resistenze; VALUE: 52k3
R7 = Resistenze:0899_CR0603FX1002ELF: 10K 1% 0603; CASE: 0603; MONTHLY_USAGE: _____; PART_NUMBER: CR0603FX1002ELF; PRICE: _____; SUPPLIER: _____; TYPE: Resistenze; VALUE: 10k_1%
R8 R9 = Resistenze:0180_52K3_0603: 52k3 0603; CASE: 0603; MONTHLY_USAGE: _____; PART_NUMBER: 52k3_0603; PRICE: _____; SUPPLIER: _____; TYPE: Resistenze
R10 R36 R39 = Resistenze:2022_CR0603FW104L: 0603 Resistor 100K 1%; PART_NUMBER: CR0603FW104L
R14 = Resistenze:0028_CR0603JW103L: 10K 0603; CASE: 0603; MONTHLY_USAGE: _____; PART_NUMBER: CR0603JW103L; PRICE: _____; SUPPLIER: _____; TYPE: Resistenze; VALUE: 10k
R15 = Resistenze:0540_CAY16-471J4LF: 470R 064R; CASE: SMD_3,2x1,6; MONTHLY_USAGE: _____; PART_NUMBER: CAY16-471J4LF; PRICE: _____; SUPPLIER: _____; TYPE: Resistenze
R18 R19 = Resistenze:0176_39_R_0603: 39R 0603; CASE: 0603; MONTHLY_USAGE: _____; PART_NUMBER: 39_R_0603; PRICE: _____; SUPPLIER: _____; TYPE: Resistenze
R20 = Resistenze:0164_6K8_0603: 6K8 0603; CASE: 0603; MONTHLY_USAGE: _____; PART_NUMBER: 6K8_0603; PRICE: _____; SUPPLIER: _____; TYPE: Resistenze
R37 = Resistenze:0194_: 22K 0603; CASE: 0603; MONTHLY_USAGE: _____; PRICE: _____; SUPPLIER: _____; TYPE: Resistenze; VALUE: 22K_1%
R40 = Resistenze:0410_47K_0603_1%: 47K 0603 1%; CASE: 0603; MONTHLY_USAGE: _____; PART_NUMBER: 47K_0603_1%; PRICE: _____; SUPPLIER: _____; TYPE: Resistenze
RESET = Switches:0946_TS42031-160W-TR-7260: Pushbutton 6x6 Smd - White; MONTHLY_USAGE: _____; PART_NUMBER: IT-1157AHNP-160G-G_GTR; PRICE: _____; SUPPLIER: _____; TYPE: Switches; VALUE: TS42
TP_0 TP_1-TP_3 TP_3V3 TP_3V31 TP_4 TP_5 TP_5V TP_6-TP_10 TP_12 TP_A0 TP_A1-TP_A5 TP_AREF TP_EDBG_FORCE_BOOT TP_GND TP_MOSI TP_PWRIN TP_RESET TP_SCK TP_SCL TP_SDA = SmartPrj:TP_SP
TR1 TR2 = Transistors:0297_PMV48XP: 20 V, 3.5 A P-channel Trench MOSFET - PMV48XP; CASE: SOT23; MONTHLY_USAGE: _____; PART_NUMBER: PMV48XP; PRICE: _____; SUPPLIER: _____; TYPE: Transistor
TR3 TR7 TR8 = Transistors:1612_2N7002LT1G: 2N7002 60 V, 300 mA N-channel Trench MOSFET
TVS1 = Protezione:XXXX_SMAJ12CA: TVS Bidirectional 400W 12V, case DO-214AC (SMA); PART_NUMBER: SMAJ12CA
U$1-U$3 = Misc:DISCLAIMER
USB1 = Connettori:0158_MCR-B-S-RA-SMT-CS1TR: Usb Micro F/90 Smd Tipo B; MONTHLY_USAGE: _____; PART_NUMBER: MCR-B-S-RA-SMT-CS1TR; PRICE: _____; SUPPLIER: _____; TYPE: Connettori
USB2 = Connettori:0631_MCR-AB1-S-RA-SMT-TR: Usb Micro F/90 Smd Tipo AB; MONTHLY_USAGE: _____; PART_NUMBER: MCR-AB1-S-RA-SMT-TR; PRICE: _____; SUPPLIER: _____; TYPE: Connettori
X1 = Connettori:0018_19746-POWER-SUPPLY: JACK; MONTHLY_USAGE: _____; PART_NUMBER: 19746; PRICE: _____; SUPPLIER: _____; TYPE: Connettori
X3 = Cristalli:0396_12MHZ-12PF-K7: 12Mhz - K7 12pF - SMD
Y4 = Cristalli:0213_ABS07-32.768KHZ-T: 32,768KHz - SMD; MONTHLY_USAGE: _____; PART_NUMBER: ABS07-32.768KHZ-T; PRICE: _____; SUPPLIER: _____; TYPE: Cristalli
Z3-Z6 = Protezione:0010_BRNCG0603MLC-05E: CG0603MLC-05E; MONTHLY_USAGE: _____; PART_NUMBER: BRNCG0603MLC-05E; PRICE: _____; SUPPLIER: _____; TYPE: Protezione

## Net classes
0 default: width 0.203 mm, drill 0.203 mm, clearance 0.178 mm
1 USB: width 0.203 mm, drill 0.305 mm, clearance 0.178 mm
2 gnd: width 0.254 mm, drill 0.254 mm, clearance 0.178 mm
3 usbvcc: width 0.203 mm, drill 0.406 mm, clearance 0.178 mm
4 USBpair: width 0.254 mm, drill 0.406 mm, clearance 0.508 mm to class 0, clearance 0.508 mm to class 1, clearance 0.508 mm to class 2, clearance 0.508 mm to class 3